# EAGLE schematic sapflow_v3 (EAGLE 9.5.2)
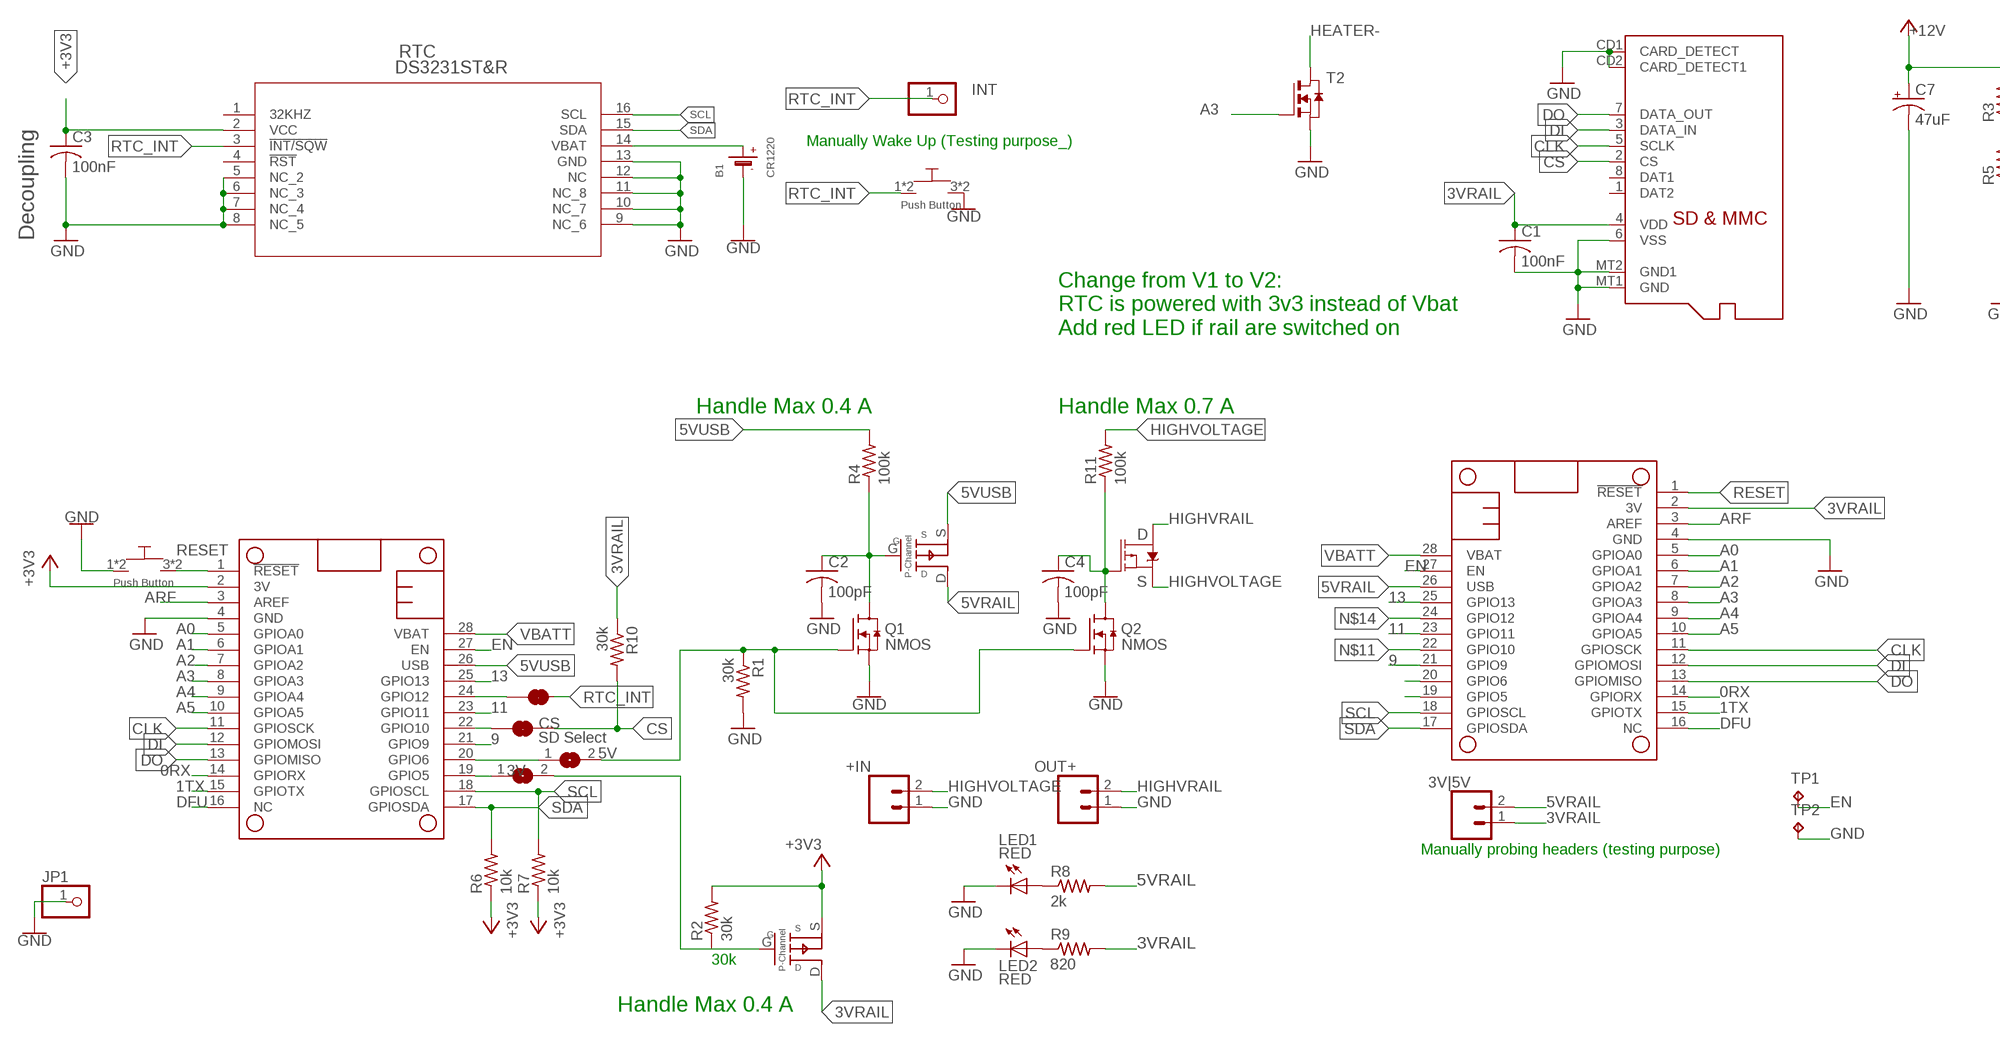
[diagram p0: schematic, sheet 1, part 1 of 2]
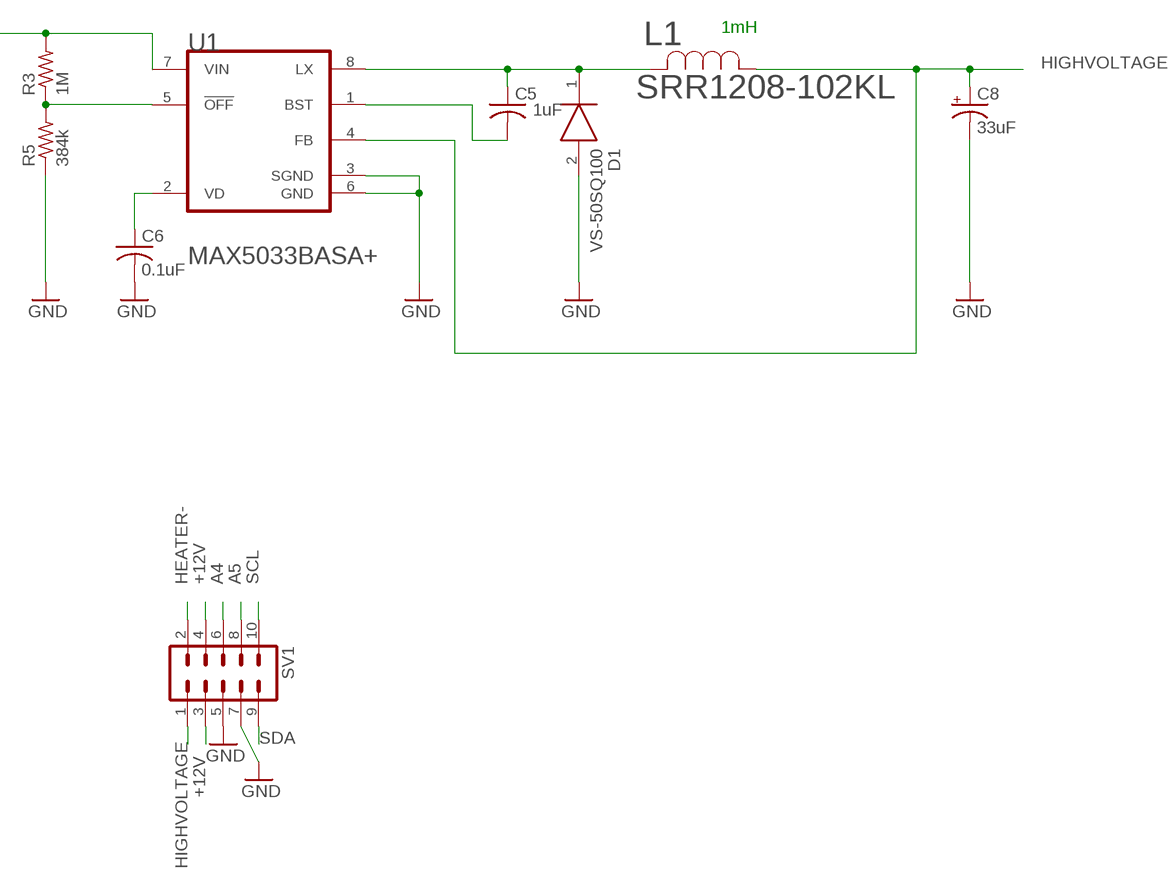
[diagram p1: schematic, sheet 1, part 2 of 2]

## Parts
3V  SJ  [SJ]
3V|5V  CONN_021X02_NO_SILK  [1X02_NO_SILK]
5V  SJ  [SJ]
+IN  HIGHV-IN  CONN_021X02_NO_SILK  [1X02_NO_SILK]
B1  CR1220  BATTERYCR1220_SMT  [CR1220]
C1  100nF  C-USC1206  [C1206]
C2  100pF  C-USC0805  [C0805]
C3  100nF  C-USC1206  [C1206]
C4  100pF  C-USC0805  [C0805]
C5  1uF  C-USC0603  [C0603]
C6  0.1uF  C-USC0603  [C0603]
C7  47uF  CPOL-USD/7343-31R  [D/7343-31R]
C8  33uF  CPOL-USD/7343-31R  [D/7343-31R]
CS  SD Select  JUMPER-SMT_2_NC_TRACE_SILK  [SMT-JUMPER_2_NC_TRACE_SILK]
D1  VS-50SQ100  [DIOAD1405W86L465D235]
INT  PINHD-1X1CB  [1X01-CLEANBIG]
JP1  PINHD-1X1CB  [1X01-CLEANBIG]
L1  SRR1208-102KL  [IND_BOURNS_SRR1208]
LED1  RED  LEDCHIPLED_0805  [CHIPLED_0805]
LED2  RED  LEDCHIPLED_0805  [CHIPLED_0805]
MICROSD  MICROSD  [MICROSD]
MS1  FEATHERWING  [FEATHERWING]
MS2  FEATHERWING  [FEATHERWING]
OUT+  HIGHV-OUT  CONN_021X02_NO_SILK  [1X02_NO_SILK]
PMOS1  SSM3J3228R  [SOT-23-3]
PMOS2  SSM3J3228R  [SOT-23-3]
PMOS3  P-MOSFET  [SOT23-6]
Q1  NMOS  [SOT23-S]
Q2  NMOS  [SOT23-S]
R1  30k  WSLP1206R0500FEA  [RES_1206]
R2  30k  WSLP1206R0500FEA  [RES_1206]
R3  1M  R-US_R0603  [R0603]
R4  100k  WSLP1206R0500FEA  [RES_1206]
R5  384k  R-US_R0603  [R0603]
R6  10k  WSLP1206R0500FEA  [RES_1206]
R7  10k  WSLP1206R0500FEA  [RES_1206]
R8  2k  WSLP1206R0500FEA  [RES_1206]
R9  820  WSLP1206R0500FEA  [RES_1206]
R10  30k  WSLP1206R0500FEA  [RES_1206]
R11  100k  WSLP1206R0500FEA  [RES_1206]
RTC  DS3231ST&R  [21-0042B_16]
RTC_INT  JUMPER-SMT_2_NC_TRACE_SILK  [SMT-JUMPER_2_NC_TRACE_SILK]
SV1  MA05-2  [MA05-2]
T2  NMOSSOT223  [SOT223]
TP1  TPTP16R  [TP16R]
TP2  TPTP16R  [TP16R]
U1  MAXIM_MAX5033BASA+MAXIM_MAX5033BASA+_0_1  [MAXIM_MAX5033BASA+_1]
U$1  PUSH_BUTTON  [PUSHBUTTON_SMD]
U$2  PUSH_BUTTON  [PUSHBUTTON_SMD]

## Nets
0RX: MS1.14(GPIORX) MS2.14(GPIORX)
1TX: MS1.15(GPIOTX) MS2.15(GPIOTX)
3VRAIL: 3V|5V.1 C1.1 MICROSD.4(VDD) MS1.2(3V) PMOS2.D R9.2 R10.1
5VRAIL: 3V|5V.2 MS1.26(USB) PMOS1.D R8.2
5VUSB: MS2.26(USB) PMOS1.S R4.2
9: MS1.21(GPIO9) MS2.21(GPIO9)
11: MS1.23(GPIO11) MS2.23(GPIO11)
13: MS1.25(GPIO13) MS2.25(GPIO13)
+3V3: C3.1 MS2.2(3V) PMOS2.S R2.2 R6.1 R7.1 RTC.2(VCC)
+12V: C7.+ R3.2 SV1.3 SV1.4 U1.7(VIN) ; supply symbol labelled 15V
A0: MS1.5(GPIOA0) MS2.5(GPIOA0)
A1: MS1.6(GPIOA1) MS2.6(GPIOA1)
A2: MS1.7(GPIOA2) MS2.7(GPIOA2)
A3: MS1.8(GPIOA3) MS2.8(GPIOA3) T2.1(G)
A4: MS1.9(GPIOA4) MS2.9(GPIOA4) SV1.6
A5: MS1.10(GPIOA5) MS2.10(GPIOA5) SV1.8
ARF: MS1.3(AREF) MS2.3(AREF)
CLK: MICROSD.5(SCLK) MS1.11(GPIOSCK) MS2.11(GPIOSCK)
CS: CS.2 MICROSD.2(CS) R10.2
DFU: MS1.16(NC) MS2.16(NC)
DI: MICROSD.3(DATA_IN) MS1.12(GPIOMOSI) MS2.12(GPIOMOSI)
DO: MICROSD.7(DATA_OUT) MS1.13(GPIOMISO) MS2.13(GPIOMISO)
EN: MS1.27(EN) MS2.27(EN) TP1.TP
GND [GND]: +IN.1 B1.- C1.2 C2.2 C3.2 C4.2 C6.2 C7.- C8.- D1.2(A) JP1.1 LED1.C LED2.C MICROSD.6(VSS) MICROSD.CD1(CARD_DETECT) MICROSD.CD2(CARD_DETECT1) MICROSD.MT1(GND) MICROSD.MT2(GND1) MS1.4(GND) MS2.4(GND) OUT+.1 Q1.2(S) Q2.2(S) R1.2 R5.1 RTC.5(NC_2) RTC.6(NC_3) RTC.7(NC_4) RTC.8(NC_5) RTC.9(NC_6) RTC.10(NC_7) RTC.11(NC_8) RTC.12(NC) RTC.13(GND) SV1.5 SV1.7 T2.3(S) TP2.TP U1.3(SGND) U1.6(GND) U$1.1 U$1.2 U$2.3 U$2.4
HEATER-: SV1.2 T2.2(D) T2.4(D)
HIGHVOLTAGE [HIGHVOLTAGE]: +IN.2 C8.+ L1.1 PMOS3.4(S) R11.2 SV1.1 U1.4(FB)
HIGHVRAIL [HIGHVOLTAGE]: OUT+.2 PMOS3.1(D) PMOS3.2(D) PMOS3.5(D) PMOS3.6(D)
N$1: 5V.1 MS2.20(GPIO6)
N$2: B1.+$1(+) RTC.14(VBAT)
N$3: 3V.1 MS2.19(GPIO5)
N$4: 5V.2 Q1.1(G) Q2.1(G) R1.1
N$5: 3V.2 PMOS2.G R2.1
N$6: C6.1 U1.2(VD)
N$7: MS1.20(GPIO6)
N$8: MS1.19(GPIO5)
N$9: R3.1 R5.2 U1.5(!OFF!)
N$10: C2.1 PMOS1.G Q1.3(D) R4.1
N$11: CS.1 MS1.22(GPIO10) MS2.22(GPIO10)
N$12: LED1.A R8.1
N$13: LED2.A R9.1
N$14: MS1.24(GPIO12) MS2.24(GPIO12) RTC_INT.1
N$15: C4.1 PMOS3.3(G) Q2.3(D) R11.1
N$16: C5.2 U1.1(BST)
N$17: C5.1 D1.1(K) L1.2 U1.8(LX)
RESET: MS1.1(!RESET) MS2.1(!RESET) U$1.3 U$1.4
RTC_INT: INT.1 RTC.3(!INT/SQW) RTC_INT.2 U$2.1 U$2.2
SCL: MS1.18(GPIOSCL) MS2.18(GPIOSCL) R7.2 RTC.16(SCL) SV1.10
SDA: MS1.17(GPIOSDA) MS2.17(GPIOSDA) R6.2 RTC.15(SDA) SV1.9
VBATT: MS1.28(VBAT) MS2.28(VBAT)
Unconnected: MICROSD.1(DAT2) MICROSD.8(DAT1) RTC.1(32KHZ) RTC.4(!RST)

## Notes on the sheet
- 1mH
- Manually Wake Up (Testing purpose_)
- Decoupling
- Change from V1 to V2:
  RTC is powered with 3v3 instead of Vbat
  Add red LED if rail are switched on
- Handle Max 0.4 A | Handle Max 0.7 A
- D
- S
- Manually probing headers (testing purpose)
- 30k
- Handle Max 0.4 A

## Library data of the parts
3V 5V = jumper:SJ: SMD solder JUMPER
3V|5V +IN OUT+ = SparkFun-Connectors:CONN_02: Multi connection point. Often used as Generic Header-pin footprint for 0.1 inch spaced/style header connections On any of the 0.1 inch spaced packages, you can populate with these: Break Away Headers - Straight <https://www.sparkfun.com/products/116> (PRT-00116) Break Away Male Headers - Right Angle <https://www.sparkfun.com/products/553> (PRT-00553) Female Headers <https://www.sparkfun.com/products/115> (PRT-00115) Break Away Headers - Machine Pin <https://www.sparkfun.com/products/117> (PRT-00117) Break Away Female Headers - Swiss Machine Pin <https://www.sparkfun.com/products/743> (PRT-00743) For SCREWTERMINALS and SPRING TERMINALS visit here: Screw Terimnals on SparkFun.com <https://www.sparkfun.com/search/results?term=Screw+Terminals> (5mm/3.5mm/2.54mm spacing) This device is also useful as a general connection point to wire up your design to another part of your project. Our various solder wires solder well into these plated through hole pads. Hook-Up Wire - Assortment (Stranded, 22 AWG) <https://www.sparkfun.com/products/11375> (PRT-11375) Hook-Up Wire - Assortment (Solid Core, 22 AWG) <https://www.sparkfun.com/products/11367> (PRT-11367) View the entire wire category on our website here <https://www.sparkfun.com/categories/141> Special notes: Molex polarized connector foot print use with: PRT-08233 with associated crimp pins and housings. 2.54_SCREWTERM for use with PRT-10571. 3.5mm Screw Terminal footprints for PRT-08084 5mm Screw Terminal footprints for use with PRT-08432
B1 = microbuilder:BATTERY: CR1220 SMT - Digikey: 3001K-ND CD2032 BAT-HLD-001 - Digikey: BAT-HLD-001-ND
C1 C3 = adafruit:C-US: CAPACITOR, American symbol
C2 C4 = resistor:C-US: CAPACITOR, American symbol
C5 C6 = rcl:C-US: CAPACITOR, American symbol; SPICEPREFIX: C
C7 C8 = rcl:CPOL-US: POLARIZED CAPACITOR, American symbol; SPICEPREFIX: C
CS RTC_INT = SparkFun-Jumpers:JUMPER-SMT_2_NC_TRACE: Normally closed trace jumper This jumper has a trace between two pads so it's normally closed (NC). Use a razor knife to open the connection. For best results follow the IPC guidelines for cutting traces: Cutout at least 0.063 mm (0.005 in). Remove all loose material to clean up the cut area. Seal the cut with an approved epoxy. Reapply solder to reclose the connection.
D1 = VS-50SQ100:VS-50SQ100: VS-50SQ100, Schottky Diode, 5A max, 100V, 2-Pin, DO-204AR Source: Datasheet <http://docs-emea.rs-online.com/webdocs/0791/0900766b8079106c.pdf>; ALLIED_NUMBER: 70078786; ALLIED_PRICE-STOCK: http://www.alliedelec.com/vishay-pcs-vs-50sq100/70078786/; DESCRIPTION: VS-50SQ100, Schottky Diode, 5A max, 100V, 2-Pin, DO-204AR; HEIGHT: mm; MANUFACTURER_NAME: Vishay; MANUFACTURER_PART_NUMBER: VS-50SQ100; MOUSER_PART_NUMBER: 844-50SQ100; MOUSER_PRICE-STOCK: https://www.mouser.com/Search/Refine.aspx?Keyword=844-50SQ100; RS_PART_NUMBER: 5446041; RS_PRICE-STOCK: https://uk.rs-online.com/web/p/products/5446041
INT JP1 = adafruit:PINHD-1X1: Pin header 1x1 for 0.1" spacing With round pins
L1 = SRR1208-102KL:SRR1208-102KL; BUILT_BY: EMA_UL_Team; MANUFACTURER_PART_NUMBER: SRR1208-102KL; VENDOR: Bourns Electronics
LED1 LED2 = adafruit:LED: LED OSRAM: - CHIPLED LG R971, LG N971, LY N971, LG Q971, LY Q971, LO R971, LY R971 LH N974, LH R974 LS Q976, LO Q976, LY Q976 LO Q996 - Hyper CHIPLED LW Q18S LB Q993, LB Q99A, LB R99A - SideLED LS A670, LO A670, LY A670, LG A670, LP A670 LB A673, LV A673, LT A673, LW A673 LH A674 LY A675 LS A676, LA A676, LO A676, LY A676, LW A676 LS A679, LY A679, LG A679 - Hyper Micro SIDELED® LS Y876, LA Y876, LO Y876, LY Y876 LT Y87S - SmartLED LW L88C, LW L88S LB L89C, LB L89S, LG L890 LS L89K, LO L89K, LY L89K LS L896, LA L896, LO L896, LY L896 - TOPLED LS T670, LO T670, LY T670, LG T670, LP T670 LSG T670, LSP T670, LSY T670, LOP T670, LYG T670 LG T671, LOG T671, LSG T671 LB T673, LV T673, LT T673, LW T673 LH T674 LS T676, LA T676, LO T676, LY T676, LB T676, LH T676, LSB T676, LW T676 LB T67C, LV T67C, LT T67C, LS T67K, LO T67K, LY T67K, LW E67C LS E67B, LA E67B, LO E67B, LY E67B, LB E67C, LV E67C, LT E67C LW T67C LS T679, LY T679, LG T679 LS T770, LO T770, LY T770, LG T770, LP T770 LB T773, LV T773, LT T773, LW T773 LH T774 LS E675, LA E675, LY E675, LS T675 LS T776, LA T776, LO T776, LY T776, LB T776 LHGB T686 LT T68C, LB T68C - Hyper Mini TOPLED® LB M676 - Mini TOPLED Santana® LG M470 LS M47K, LO M47K, LY M47K Source: http://www.osram.convergy.de/
MICROSD = adafruit:MICROSD: Micro-SD / Transflash card holder with SPI pinout For the 3M # 2908-05WB-MG and/or 4UCON #19656 push-push type
MS1 = powerboard:FEATHERWING
MS2 = adafruit:FEATHERWING
PMOS1 PMOS2 = M0_Power:SSM3J3228R: P-Channel MOSFET, SOT-23-3 SMD Package
PMOS3 = eDNA:P-MOSFET: P-channel mosfet P-Channel 30V 4.3A (Ta) 1.25W (Ta) Surface Mount SOT-26 https://www.digikey.com/product-detail/en/diodes-incorporated/DMP3056LDM-7/DMP3056LDMDICT-ND/1964772
Q1 Q2 = eDNA:NMOS
R1 R2 R4 R6-R11 = Resistor_Capacitor:WSLP1206R0500FEA: RES 0.05 OHM 1% 1W 1206 Manufacturer's datasheet <http://www.vishay.com/docs/30122/wslp.pdf>; CREATED_BY: PCBLayout.com; DIGIKEY_PART_NUMBER: WSLP-.05TR-ND; MANUFACTURER: Vishay Dale; MPN: WSLP1206R0500FEA; PACKAGE: SMD 1206
R3 R5 = rcl:R-US_: RESISTOR, American symbol; SPICEPREFIX: R
RTC = power8:DS3231ST&R: DS3231 RTC IC only; MANUFACTURER_PART_NUMBER: DS3231S#T&R; VENDOR: Maxim Integrated Products
SV1 = con-lstb:MA05-2: PIN HEADER; OC_FARNELL: unknown; OC_NEWARK: unknown
T2 = zetex:NMOSSOT223: MOS FET; OC_FARNELL: unknown; OC_NEWARK: unknown
TP1 TP2 = testpad:TP: Test pad
U1 = Maxim - MAX5033BASA+:MAXIM_MAX5033BASA+: MAX-MAX5033-IL8; CIIVA_IDS: 1484514; CODE__IPC: SOIC127P600-8; CODE__JEDEC: MS-012-AA; COMPONENT_LINK_1_DESCRIPTION: Manufacturer URL; COMPONENT_LINK_1_URL: http://www.maxim-ic.com; COMPONENT_LINK_3_DESCRIPTION: Package Specification; COMPONENT_LINK_3_URL: http://pdfserv.maxim-ic.com/package_dwgs/21-0041.PDF; DATASHEET: http://datasheets.maxim-ic.com/en/ds/MAX5033.pdf; DATASHEET_VERSION: Rev 5, May-2011; FOOTPRINT_VARIANT_NAME_0: Level C; FOOTPRINT_VARIANT_NAME_1: Level B; FOOTPRINT_VARIANT_NAME_2: Level A; IMPORTED: yes; IMPORTED_FROM: vault; IMPORT_TS: 1521862065; MF: Maxim; MPN: MAX5033BASA+; PACKAGE: S8+5; PACKAGE_DESCRIPTION: 8-Pin Small-Outline IC, Narrow (0.15in), 1.27 mm Pitch, SOIC (N), Pb-Free; PACKAGE_VERSION: revC, 2010; PREFIX: U; RELEASE_DATE: 1332919945; VAULT_GUID: 1E7CABE1-80B5-44B1-A1B1-D79A0DB0D6E1; VAULT_REVISION: 223A1D72-BB07-4F7F-9695-43D469E578B1
U$1 U$2 = eDNA:PUSH_BUTTON: SMD low profile push-button NOPE https://www.mouser.com/ProductDetail/ALPS/SKTHAHE010?qs=sGAEpiMZZMsgGjVA3toVBFPD9IcV2kPoEtmOqlcDILk%3D https://www.digikey.com/product-detail/en/c-k/KMR731NG-LFS/CKN10687TR-ND/6035353 https://www.arrow.com/en/products/kmr731nglfs/ck https://www.mouser.com/ProductDetail/CK/KMR731NGLFS?qs=%2Fha2pyFaduiYmAh2YH01EjoHSsd%2F4x%252BsVgk0GVi4JwmLxfMBh2nzdw%3D%3D

## Net classes
0 default: clearance 0.205 mm
1 GND: clearance 0.205 mm to class 0, clearance 0.205 mm
2 HIGHVOLTAGE: clearance 0.205 mm to class 0, clearance 0.205 mm to class 1, clearance 0.3 mm